# Altium schematic sheet Sheet1.SchDoc
size 1016 x 762 mm; SheetNumber: 1; SheetTotal: 1
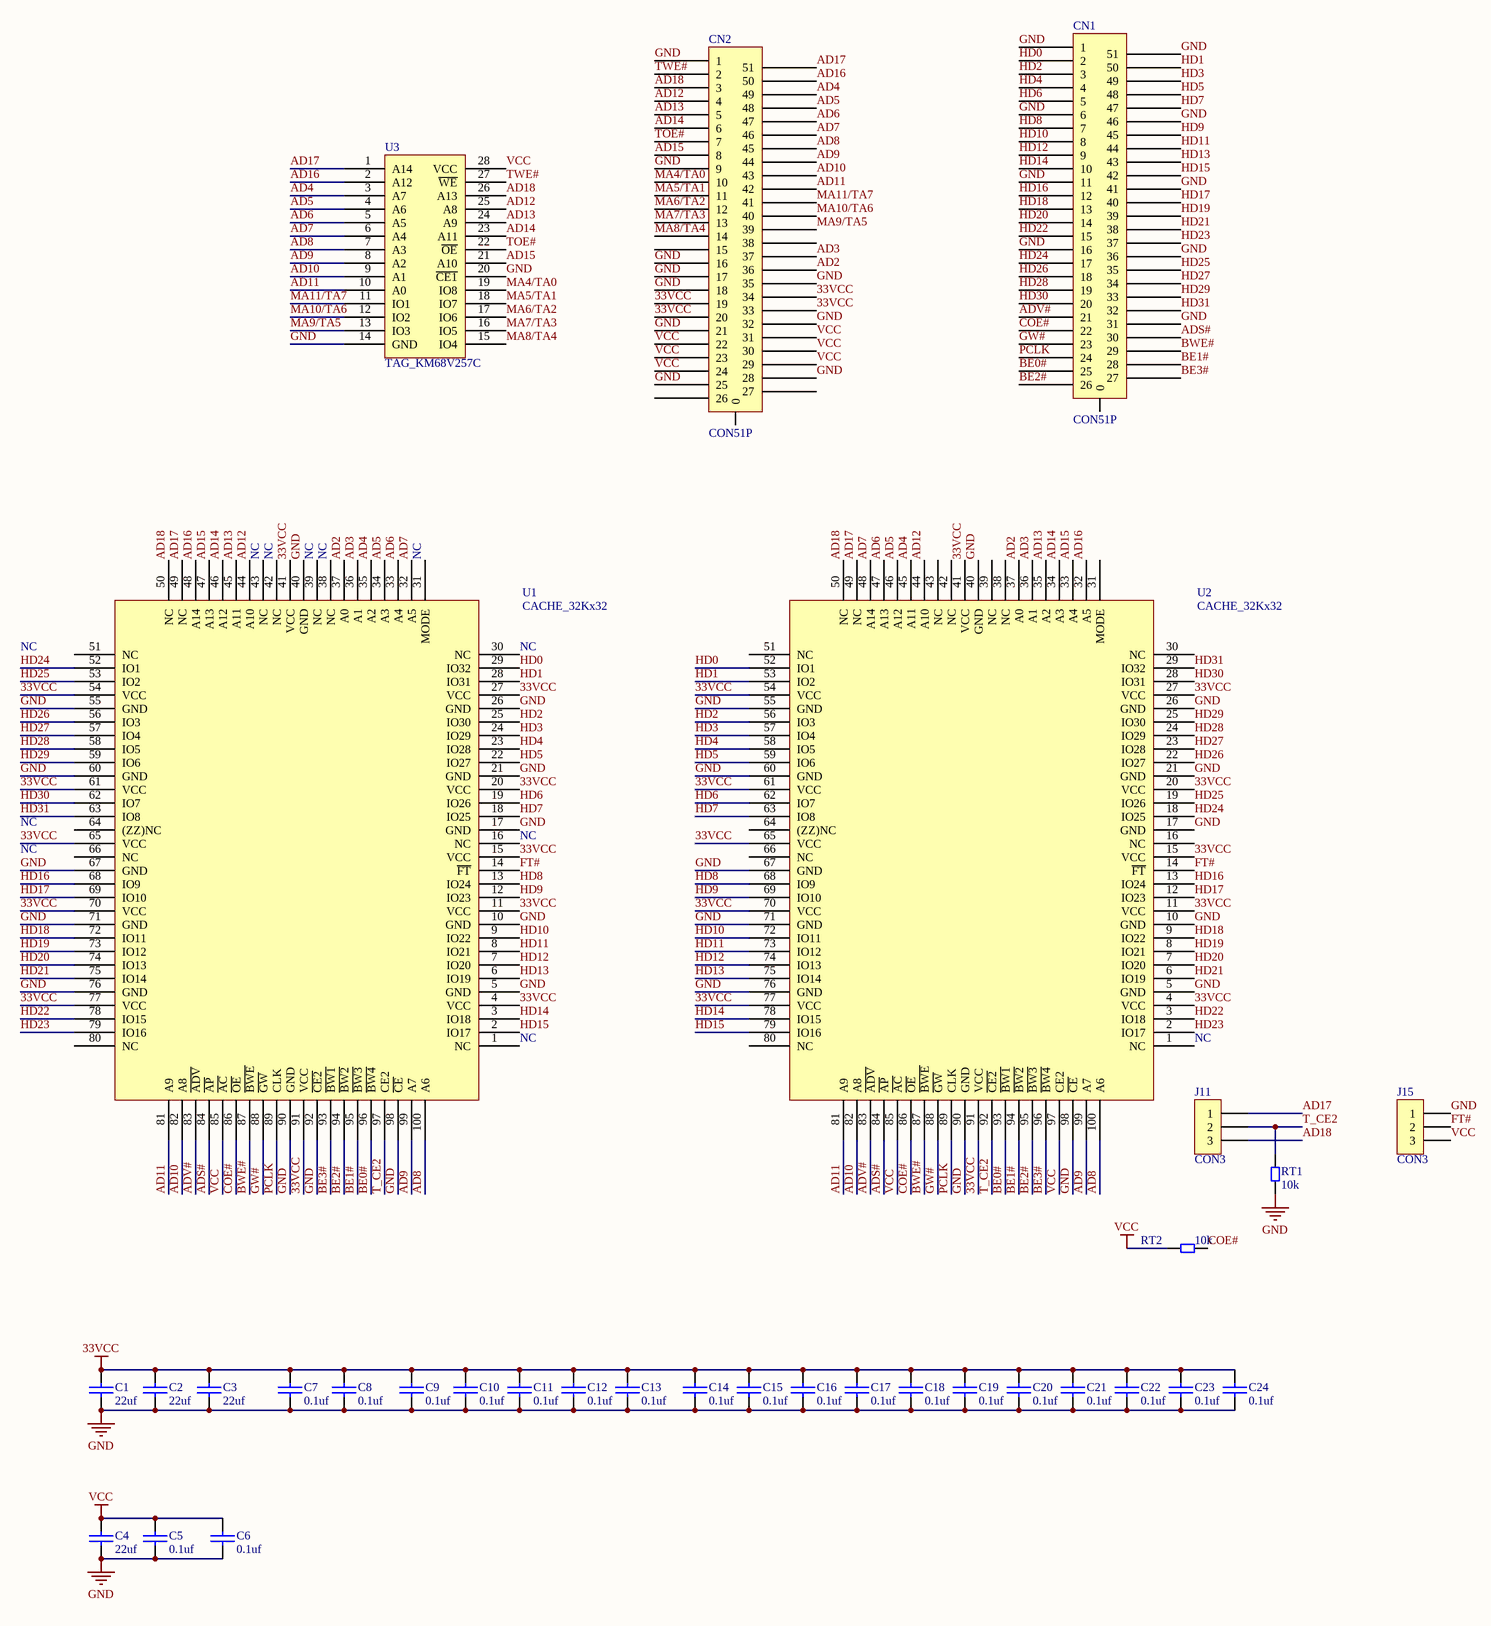
[diagram p0: Sheet1.SchDoc]

## Parts
C1  22uf  [C0603]
C2  22uf  [C0603]
C3  22uf  [C0603]
C4  22uf  [C0603]
C5  0.1uf  [C0603]
C6  0.1uf  [C0603]
C7  0.1uf  [C0603]
C8  0.1uf  [C0603]
C9  0.1uf  [C0603]
C10  0.1uf  [C0603]
C11  0.1uf  [C0603]
C12  0.1uf  [C0603]
C13  0.1uf  [C0603]
C14  0.1uf  [C0603]
C15  0.1uf  [C0603]
C16  0.1uf  [C0603]
C17  0.1uf  [C0603]
C18  0.1uf  [C0603]
C19  0.1uf  [C0603]
C20  0.1uf  [C0603]
C21  0.1uf  [C0603]
C22  0.1uf  [C0603]
C23  0.1uf  [C0603]
C24  0.1uf  [C0603]
CN1  CON51P  [BTB1.0-51P]
CN2  CON51P  [BTB1.0-51P]
J11  CON3  [JMP]
J15  CON3  [JMP]
RT1  10k  [R0603]
RT2  10k  [R0603]
U1  CACHE_32Kx32  [PQFP100B]
U2  CACHE_32Kx32  [PQFP100B]
U3  TAG_KM68V257C  [SOJ-28]

## Nets
33VCC: C1.1 C2.1 C3.1 C7.1 C8.1 C9.1 C10.1 C11.1 C12.1 C13.1 C14.1 C15.1 C16.1 C17.1 C18.1 C19.1 C20.1 C21.1 C22.1 C23.1 C24.1 CN2.19 CN2.20 CN2.33 CN2.34 U1.4(VCC) U1.11(VCC) U1.15(VCC) U1.20(VCC) U1.27(VCC) U1.41(VCC) U1.54(VCC) U1.61(VCC) U1.65(VCC) U1.70(VCC) U1.77(VCC) U1.91(VCC) U2.4(VCC) U2.11(VCC) U2.15(VCC) U2.20(VCC) U2.27(VCC) U2.41(VCC) U2.54(VCC) U2.61(VCC) U2.65(VCC) U2.70(VCC) U2.77(VCC) U2.91(VCC)
GND: C1.2 C2.2 C3.2 C4.2 C5.2 C6.2 C7.2 C8.2 C9.2 C10.2 C11.2 C12.2 C13.2 C14.2 C15.2 C16.2 C17.2 C18.2 C19.2 C20.2 C21.2 C22.2 C23.2 C24.2 CN1.1 CN1.6 CN1.11 CN1.16 CN1.31 CN1.36 CN1.41 CN1.46 CN1.51 CN2.1 CN2.9 CN2.16 CN2.17 CN2.18 CN2.21 CN2.25 CN2.28 CN2.32 CN2.35 J15.1 RT1.2 U1.5(GND) U1.10(GND) U1.17(GND) U1.21(GND) U1.26(GND) U1.40(GND) U1.55(GND) U1.60(GND) U1.67(GND) U1.71(GND) U1.76(GND) U1.90(GND) U1.92(~{CE2}) U1.98(~{CE}) U2.5(GND) U2.10(GND) U2.17(GND) U2.21(GND) U2.26(GND) U2.40(GND) U2.55(GND) U2.60(GND) U2.67(GND) U2.71(GND) U2.76(GND) U2.90(GND) U2.98(~{CE}) U3.14(GND) U3.20(~{CE1})
VCC: C4.1 C5.1 C6.1 CN2.22 CN2.23 CN2.24 CN2.29 CN2.30 CN2.31 J15.3 RT2.2 U1.85(~{AC}) U2.85(~{AC}) U2.97(CE2) U3.28(VCC)
AD2: CN2.36 U1.37(A0) U2.37(A0)
AD3: CN2.37 U1.36(A1) U2.36(A1)
AD4: CN2.49 U1.35(A2) U2.45(A11) U3.3(A7)
AD5: CN2.48 U1.34(A3) U2.46(A12) U3.4(A6)
AD6: CN2.47 U1.33(A4) U2.47(A13) U3.5(A5)
AD7: CN2.46 U1.32(A5) U2.48(A14) U3.6(A4)
AD8: CN2.45 U1.100(A6) U2.100(A6) U3.7(A3)
AD9: CN2.44 U1.99(A7) U2.99(A7) U3.8(A2)
AD10: CN2.43 U1.82(A8) U2.82(A8) U3.9(A1)
AD11: CN2.42 U1.81(A9) U2.81(A9) U3.10(A0)
AD12: CN2.4 U1.44(A10) U2.44(A10) U3.25(A8)
AD13: CN2.5 U1.45(A11) U2.35(A2) U3.24(A9)
AD14: CN2.6 U1.46(A12) U2.34(A3) U3.23(A11)
AD15: CN2.8 U1.47(A13) U2.33(A4) U3.21(A10)
AD16: CN2.50 U1.48(A14) U2.32(A5) U3.2(A12)
AD17: CN2.51 J11.1 U1.49(NC) U2.49(NC) U3.1(A14)
AD18: CN2.3 J11.3 U1.50(NC) U2.50(NC) U3.26(A13)
ADS#: CN1.30 U1.84(~{AP}) U2.84(~{AP})
ADV#: CN1.21 U1.83(~{ADV}) U2.83(~{ADV})
BE0#: CN1.25 U1.96(~{BW4}) U2.93(~{BW1})
BE1#: CN1.28 U1.95(~{BW3}) U2.94(~{BW2})
BE2#: CN1.26 U1.94(~{BW2}) U2.95(~{BW3})
BE3#: CN1.27 U1.93(~{BW1}) U2.96(~{BW4})
BWE#: CN1.29 U1.87(~{BWE}) U2.87(~{BWE})
COE#: CN1.22 RT2.1 U1.86(~{OE}) U2.86(~{OE})
FT#: J15.2 U1.14(~{FT}) U2.14(~{FT})
GW#: CN1.23 U1.88(~{GW}) U2.88(~{GW})
HD0: CN1.2 U1.29(IO32) U2.52(IO1)
HD1: CN1.50 U1.28(IO31) U2.53(IO2)
HD2: CN1.3 U1.25(IO30) U2.56(IO3)
HD3: CN1.49 U1.24(IO29) U2.57(IO4)
HD4: CN1.4 U1.23(IO28) U2.58(IO5)
HD5: CN1.48 U1.22(IO27) U2.59(IO6)
HD6: CN1.5 U1.19(IO26) U2.62(IO7)
HD7: CN1.47 U1.18(IO25) U2.63(IO8)
HD8: CN1.7 U1.13(IO24) U2.68(IO9)
HD9: CN1.45 U1.12(IO23) U2.69(IO10)
HD10: CN1.8 U1.9(IO22) U2.72(IO11)
HD11: CN1.44 U1.8(IO21) U2.73(IO12)
HD12: CN1.9 U1.7(IO20) U2.74(IO13)
HD13: CN1.43 U1.6(IO19) U2.75(IO14)
HD14: CN1.10 U1.3(IO18) U2.78(IO15)
HD15: CN1.42 U1.2(IO17) U2.79(IO16)
HD16: CN1.12 U1.68(IO9) U2.13(IO24)
HD17: CN1.40 U1.69(IO10) U2.12(IO23)
HD18: CN1.13 U1.72(IO11) U2.9(IO22)
HD19: CN1.39 U1.73(IO12) U2.8(IO21)
HD20: CN1.14 U1.74(IO13) U2.7(IO20)
HD21: CN1.38 U1.75(IO14) U2.6(IO19)
HD22: CN1.15 U1.78(IO15) U2.3(IO18)
HD23: CN1.37 U1.79(IO16) U2.2(IO17)
HD24: CN1.17 U1.52(IO1) U2.18(IO25)
HD25: CN1.35 U1.53(IO2) U2.19(IO26)
HD26: CN1.18 U1.56(IO3) U2.22(IO27)
HD27: CN1.34 U1.57(IO4) U2.23(IO28)
HD28: CN1.19 U1.58(IO5) U2.24(IO29)
HD29: CN1.33 U1.59(IO6) U2.25(IO30)
HD30: CN1.20 U1.62(IO7) U2.28(IO31)
HD31: CN1.32 U1.63(IO8) U2.29(IO32)
MA4/TA0: CN2.10 U3.19(IO8)
MA5/TA1: CN2.11 U3.18(IO7)
MA6/TA2: CN2.12 U3.17(IO6)
MA7/TA3: CN2.13 U3.16(IO5)
MA8/TA4: CN2.14 U3.15(IO4)
MA9/TA5: CN2.39 U3.13(IO3)
MA10/TA6: CN2.40 U3.12(IO2)
MA11/TA7: CN2.41 U3.11(IO1)
PCLK: CN1.24 U1.89(CLK) U2.89(CLK)
T_CE2: J11.2 RT1.1 U1.97(CE2) U2.92(~{CE2})
TOE#: CN2.7 U3.22(~{OE})
TWE#: CN2.2 U3.27(~{WE})

Not connected (* = marked no-connect by the designer): CN1 0; CN2 0 15 26 27 38; U1 1(NC) 16(NC) 30(NC) 31(MODE) 38(NC) 39(NC) 42(NC) 43(NC) 51(NC) 64((ZZ)NC) 66(NC) 80(NC); U2 1(NC) 16(NC) 30(NC) 31(MODE) 38(NC) 39(NC) 42(NC) 43(NC) 51(NC) 64((ZZ)NC) 66(NC) 80(NC)

## Notes on the sheet
- (near U1) NC
- NC
- (near U2) NC

## Library data of the parts
C1-C24 = CAP
RT1 RT2 = RES2